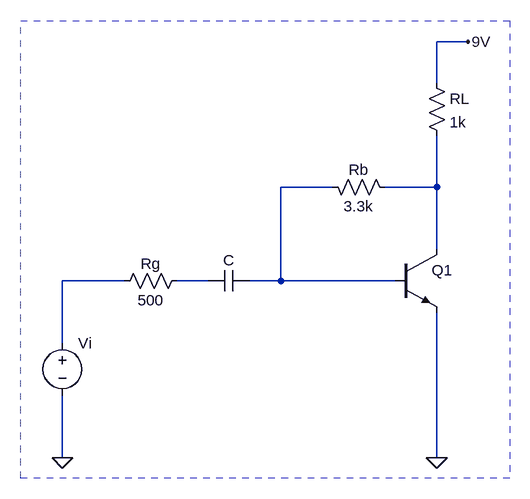
[diagram p0: schematic Ej 1.10a.asc]
Ej 1.10a.asc, the LTspice schematic file:
Version 4
SHEET 1 7076 6404
WIRE 608 48 560 48
WIRE 560 112 560 48
WIRE 400 272 320 272
WIRE 560 272 560 192
WIRE 560 272 480 272
WIRE 560 368 560 272
WIRE 80 416 -16 416
WIRE 208 416 160 416
WIRE 320 416 320 272
WIRE 320 416 272 416
WIRE 496 416 320 416
WIRE -16 512 -16 416
WIRE -16 688 -16 592
WIRE 560 688 560 464
FLAG 560 688 0
FLAG -16 688 0
FLAG 608 48 9V
SYMBOL npn 496 368 R0
WINDOW 3 56 68 Invisible 2
SYMATTR InstName Q1
SYMBOL res 496 288 M270
WINDOW 0 27 56 VTop 2
WINDOW 3 2 56 VBottom 2
SYMATTR InstName Rb
SYMATTR Value 3.3k
SYMBOL res 64 432 R270
WINDOW 0 27 56 VTop 2
WINDOW 3 2 56 VBottom 2
SYMATTR InstName Rg
SYMATTR Value 500
SYMBOL voltage -16 496 R0
WINDOW 3 24 96 Invisible 2
SYMATTR InstName Vi
SYMBOL res 544 96 R0
SYMATTR InstName RL
SYMATTR Value 1k
SYMBOL cap 272 400 R90
WINDOW 0 0 32 VBottom 2
WINDOW 3 32 32 Invisible 2
SYMATTR InstName C
RECTANGLE Normal 672 720 -80 16 2

The netlist it stands for:
* Ej 1.10a.asc
Q1 N002 N001 0 0 NPN
Rb N002 N001 3.3k
Rg N003 N004 500
Vi N003 0 V
RL 9V N002 1k
C N001 N004 C
.model NPN NPN
.model PNP PNP
.lib standard.bjt
.backanno
.end